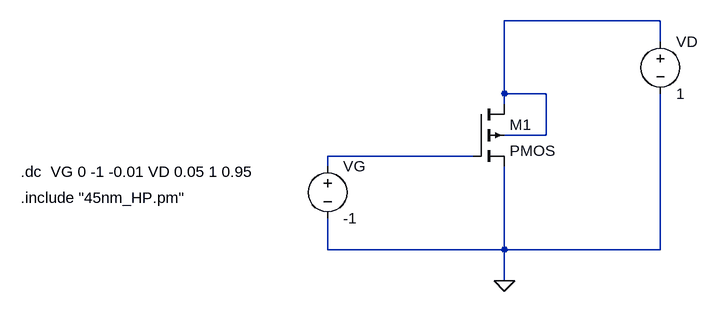
[diagram p0: schematic 45p_IDVG.asc]
45p_IDVG.asc, the LTspice schematic file:
Version 4
SHEET 1 880 680
WIRE 448 -16 208 -16
WIRE 448 16 448 -16
WIRE 208 96 208 -16
WIRE 272 96 208 96
WIRE 208 112 208 96
WIRE 272 160 272 96
WIRE 272 160 208 160
WIRE 160 192 -64 192
WIRE -64 208 -64 192
WIRE -64 336 -64 288
WIRE 208 336 208 208
WIRE 208 336 -64 336
WIRE 448 336 448 96
WIRE 448 336 208 336
WIRE 208 384 208 336
FLAG 208 384 0
SYMBOL pmos4 160 112 R0
SYMATTR InstName M1
SYMATTR Value2 l=45n w=90n
SYMBOL voltage -64 192 R0
WINDOW 123 0 0 Left 0
WINDOW 39 0 0 Left 0
SYMATTR InstName VG
SYMATTR Value -1
SYMBOL voltage 448 0 R0
WINDOW 123 0 0 Left 0
WINDOW 39 0 0 Left 0
SYMATTR InstName VD
SYMATTR Value 1
TEXT -536 216 Left 2 !.dc  VG 0 -1 -0.01 VD 0.05 1 0.95
TEXT -536 256 Left 2 !.include "45nm_HP.pm"

The netlist it stands for:
* 45p_IDVG.asc
M1 N001 N002 0 N001 PMOS l=45n w=90n
VG N002 0 -1
VD N001 0 1
.model NMOS NMOS
.model PMOS PMOS
.lib standard.mos
.dc  VG 0 -1 -0.01 VD 0.05 1 0.95
.include "45nm_HP.pm"
.backanno
.end